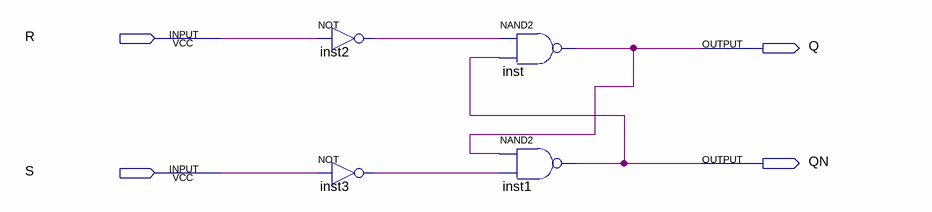
[diagram p0: schematic sheet]
// Quartus schematic lab9step1b.bdf as structural Verilog: 4 symbols, 4 pins
module lab9step1b (
  input  R,
  input  S,
  output Q,
  output QN
);

  wire inst2_out, inst3_out;

  not inst2 (inst2_out, R);
  not inst3 (inst3_out, S);
  nand inst (Q, inst2_out, QN);
  nand inst1 (QN, Q, inst3_out);
endmodule
